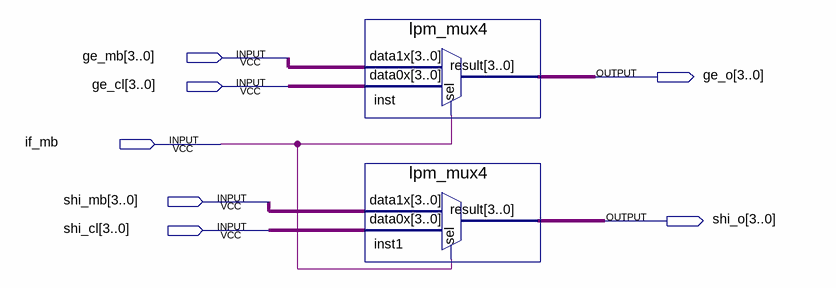
[diagram p0: schematic sheet]
// Quartus schematic choose_mb.bdf as structural Verilog: 2 symbols, 7 pins
module choose_mb (
  input  [3:0] ge_mb,
  input  [3:0] ge_cl,
  input  if_mb,
  input  [3:0] shi_mb,
  input  [3:0] shi_cl,
  output [3:0] ge_o,
  output [3:0] shi_o
);

  lpm_mux4 inst (.data1x(ge_mb), .data0x(ge_cl), .sel(if_mb), .result(ge_o));
  lpm_mux4 inst1 (.data1x(shi_mb), .data0x(shi_cl), .sel(if_mb), .result(shi_o));
endmodule
